# EAGLE schematic midipal-v02 (EAGLE 5.09)
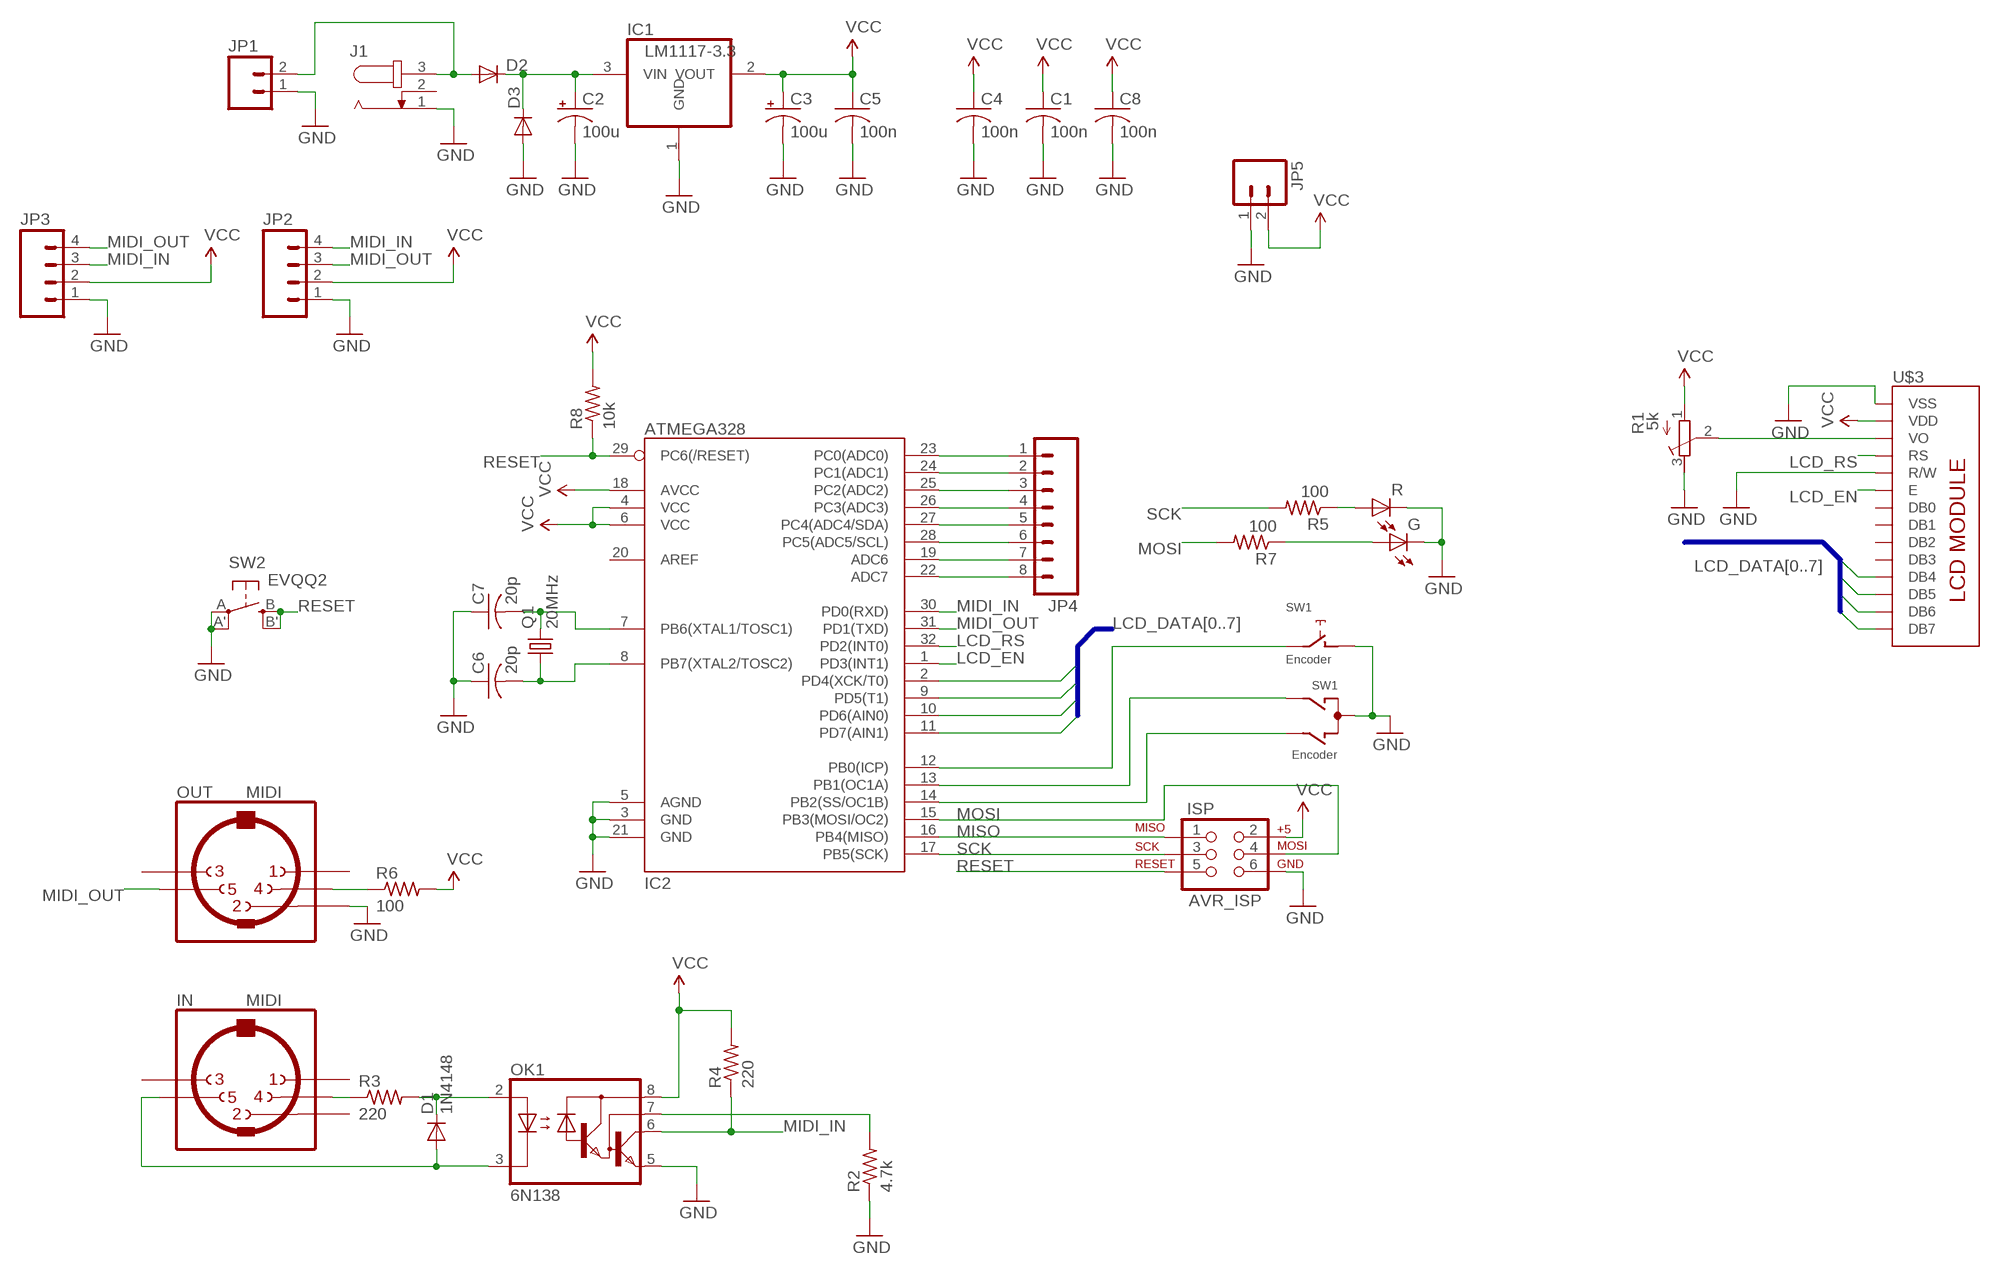
[diagram p0: schematic, sheet 1]

## Parts
C1  100n  C-USC0805  [C0805]
C2  100u  CPOL-USD  [PANASONIC_D]
C3  100u  CPOL-USD  [PANASONIC_D]
C4  100n  C-USC0805  [C0805]
C5  100n  C-USC0805  [C0805]
C6  20p  C-USC0805  [C0805]
C7  20p  C-USC0805  [C0805]
C8  100n  C-USC0805  [C0805]
D1  1N4148  DIODE-SOD323-W  [SOD323-W]
D2  DIODESMB  [SMB-DIODE]
D3  DIODESMB  [SMB-DIODE]
G  LEDCHIPLED_1206  [CHIPLED_1206]
IC1  LM1117-3.3  REG1117  [SOT223]
IC2  ATMEGA328  ATMEGA168  [TQFP32-08]
IN  MIDI  MAB5SH  [MAB5SH]
ISP  AVR_ISP  AVR_SPI_PRG_6PTH  [2X3]
J1  JACK-PLUG2  [SPC4078_BIG_HOLES]
JP1  M02  [1X02_LONGPADS]
JP2  M04PTH  [1X04]
JP3  M04PTH  [1X04]
JP4  M08  [1X08]
JP5  M02PTH  [1X02]
OK1  6N138  6N138SMD8  [DIL8-SMD]
OUT  MIDI  MAB5SH  [MAB5SH]
Q1  20MHz  CRYSTALHC49UP  [HC49UP]
R  LEDCHIPLED_1206  [CHIPLED_1206]
R1  5k  R-TRIMM3296P  [RTRIM3296P]
R2  4.7k  R-US_M0805  [M0805]
R3  220  R-US_M0805  [M0805]
R4  220  R-US_R0805  [R0805]
R5  100  R-US_R0805  [R0805]
R6  100  R-US_R0805  [R0805]
R7  100  R-US_R0805  [R0805]
R8  10k  R-US_R0805  [R0805]
SW1  Encoder  EC12E_SW  [ALPS_EC12E_SW]
SW2  EVQQ2  [EVQ-Q2]
U$3  LCD_MODULE_NO_BKL  [LCD_MODULE_1X8]

## Nets
GND: C1.2 C2.- C3.- C4.2 C5.2 C6.1 C7.1 C8.2 D3.A G.C IC1.1(GND) IC2.3(GND) IC2.5(AGND) IC2.21(GND) ISP.6 J1.1 JP1.1 JP2.1 JP3.1 JP5.1 OK1.5(GND) OUT.2 R1.3(A) R2.1 R.C SW1.C SW1.D SW2.A'(P1) SW2.A(P) U$3.1(VSS) U$3.5(R/W)
LCD_DATA4: IC2.2(PD4(XCK/T0)) U$3.11(DB4)
LCD_DATA5: IC2.9(PD5(T1)) U$3.12(DB5)
LCD_DATA6: IC2.10(PD6(AIN0)) U$3.13(DB6)
LCD_DATA7: IC2.11(PD7(AIN1)) U$3.14(DB7)
LCD_EN: IC2.1(PD3(INT1)) U$3.6(E)
LCD_RS: IC2.32(PD2(INT0)) U$3.4(RS)
MIDI_IN: IC2.30(PD0(RXD)) JP2.4 JP3.3 OK1.6(VO) R4.1
MIDI_OUT: IC2.31(PD1(TXD)) JP2.3 JP3.4 OUT.5
MISO: IC2.16(PB4(MISO)) ISP.1
MOSI: IC2.15(PB3(MOSI/OC2)) ISP.4 R7.2
N$2: C2.+ D2.C D3.C IC1.3(VIN)
N$3: IC2.23(PC0(ADC0)) JP4.1
N$5: IC2.24(PC1(ADC1)) JP4.2
N$6: IC2.25(PC2(ADC2)) JP4.3
N$7: IC2.26(PC3(ADC3)) JP4.4
N$8: IC2.27(PC4(ADC4/SDA)) JP4.5
N$9: IC2.28(PC5(ADC5/SCL)) JP4.6
N$10: IC2.19(ADC6) JP4.7
N$11: IC2.22(ADC7) JP4.8
N$12: G.A R7.1
N$13: OK1.7(VB) R2.2
N$14: R5.1 R.A
N$15: IC2.14(PB2(SS/OC1B)) SW1.B
N$16: IC2.13(PB1(OC1A)) SW1.A
N$17: IC2.12(PB0(ICP)) SW1.E
N$18: R1.2(S) U$3.3(VO)
N$28: D1.C OK1.2(A) R3.2
N$68: OUT.4 R6.1
N$72: IN.4 R3.1
N$73: D1.A IN.5 OK1.3(C)
N$82: C6.2 IC2.8(PB7(XTAL2/TOSC2)) Q1.1
N$83: C7.2 IC2.7(PB6(XTAL1/TOSC1)) Q1.2
RESET: IC2.29(PC6(/RESET)) ISP.5 R8.1 SW2.B'(S1) SW2.B(S)
SCK: IC2.17(PB5(SCK)) ISP.3 R5.2
VCC: C1.1 C3.+ C4.1 C5.1 C8.1 IC1.2(VOUT) IC2.4(VCC) IC2.6(VCC) IC2.18(AVCC) ISP.2 JP2.2 JP3.2 JP5.2 OK1.8(VCC) R1.1(E) R4.2 R6.2 R8.2 U$3.2(VDD)
VIN: D2.A J1.3 JP1.2
Unconnected: IC2.20(AREF) IN.1 IN.2 IN.3 J1.2 OUT.1 OUT.3 SW1.GND1(G) SW1.GND2(G) U$3.7(DB0) U$3.8(DB1) U$3.9(DB2) U$3.10(DB3)

## Buses
LCD_DATA[0..7]

## Library data of the parts
C1 C4-C8 = rcl:C-US: CAPACITOR, American symbol
C2 C3 = rcl:CPOL-US: POLARIZED CAPACITOR, American symbol
D1 = diode:DIODE-: DIODE
D2 D3 = SparkFun:DIODE: Diode These are standard reverse protection diodes and small signal diodes. SMA package can handle up to about 1A. SOD-323 can handle about 200mA. What the SOD-323 package when ordering, there are some mfgs out there that are 5-pin packages.
G R = led:LED: LED OSRAM: - CHIPLED LG R971, LG N971, LY N971, LG Q971, LY Q971, LO R971, LY R971 LH N974, LH R974 LS Q976, LO Q976, LY Q976 LO Q996 - Hyper CHIPLED LW Q18S LB Q993, LB Q99A, LB R99A - SideLED LS A670, LO A670, LY A670, LG A670, LP A670 LB A673, LV A673, LT A673, LW A673 LH A674 LY A675 LS A676, LA A676, LO A676, LY A676, LW A676 LS A679, LY A679, LG A679 - Hyper Micro SIDELED® LS Y876, LA Y876, LO Y876, LY Y876 LT Y87S - SmartLED LW L88C, LW L88S LB L89C, LB L89S, LG L890 LS L89K, LO L89K, LY L89K LS L896, LA L896, LO L896, LY L896 - TOPLED LS T670, LO T670, LY T670, LG T670, LP T670 LSG T670, LSP T670, LSY T670, LOP T670, LYG T670 LG T671, LOG T671, LSG T671 LB T673, LV T673, LT T673, LW T673 LH T674 LS T676, LA T676, LO T676, LY T676, LB T676, LH T676, LSB T676, LW T676 LB T67C, LV T67C, LT T67C, LS T67K, LO T67K, LY T67K, LW E67C LS E67B, LA E67B, LO E67B, LY E67B, LB E67C, LV E67C, LT E67C LW T67C LS T679, LY T679, LG T679 LS T770, LO T770, LY T770, LG T770, LP T770 LB T773, LV T773, LT T773, LW T773 LH T774 LS E675, LA E675, LY E675, LS T675 LS T776, LA T776, LO T776, LY T776, LB T776 LHGB T686 LT T68C, LB T68C - Hyper Mini TOPLED® LB M676 - Mini TOPLED Santana® LG M470 LS M47K, LO M47K, LY M47K Source: http://www.osram.convergy.de LUXEON: - LUMILED® LXK2-PW12-R00, LXK2-PW12-S00, LXK2-PW14-U00, LXK2-PW14-V00 LXK2-PM12-R00, LXK2-PM12-S00, LXK2-PM14-U00 LXK2-PE12-Q00, LXK2-PE12-R00, LXK2-PE12-S00, LXK2-PE14-T00, LXK2-PE14-U00 LXK2-PB12-K00, LXK2-PB12-L00, LXK2-PB12-M00, LXK2-PB14-N00, LXK2-PB14-P00, LXK2-PB14-Q00 LXK2-PR12-L00, LXK2-PR12-M00, LXK2-PR14-Q00, LXK2-PR14-R00 LXK2-PD12-Q00, LXK2-PD12-R00, LXK2-PD12-S00 LXK2-PH12-R00, LXK2-PH12-S00 LXK2-PL12-P00, LXK2-PL12-Q00, LXK2-PL12-R00 Source: www.luxeon.com KINGBRIGHT: KA-3528ASYC Source: www.kingbright.com
IC1 = burr-brown:REG1117: 800mA and 1A Low Dropout (LDO) Positive Regulator 1.8V, 2.5V, 2.85V, 3.3V, 5V, and Adj
IC2 = SparkFun:ATMEGA168
IN OUT = og-midi:MAB5SH: Female CONNECTOR 5 pins 90 deg. with shield, horizontal (DIN 41524)
ISP = SparkFun:AVR_SPI_PRG_6: AVR ISP 6 Pin This is the reduced ISP connector for AVR programming. Common on Arduino. This footprint will take up less PCB space and can be used with a 10-pin to 6-pin adapter such as SKU: BOB-08508
J1 = con-jack2:JACK-PLUG: DC POWER JACK Power Jack, DC, Right Angle, Through Hole, Rated 5A at 16VDC, PC Terminals Distributor: Farnell (www.Farnell.de) Drawing: 84N1161.pdf / 84N1162.pdf Manufacturer: SPC Technology (www.spctechnology.com) Type: SPC4077 / SPC 4078
JP1 JP5 = SparkFun:M02: Header 2 Standard 2-pin 0.1" header. Use with straight break away headers (SKU : PRT-00116), right angle break away headers (PRT-00553), swiss pins (PRT-00743), machine pins (PRT-00117), and female headers (PRT-00115). Molex polarized connector foot print use with SKU : PRT-08233 with associated crimp pins and housings.
JP2 JP3 = SparkFun:M04: Header 4 Standard 4-pin 0.1" header. Use with straight break away headers (SKU : PRT-00116), right angle break away headers (PRT-00553), swiss pins (PRT-00743), machine pins (PRT-00117), and female headers (PRT-00115). Molex polarized connector foot print use with SKU : PRT-08231 with associated crimp pins and housings.
JP4 = SparkFun:M08: Header 8 Standard 8-pin 0.1" header. Use with straight break away headers (SKU : PRT-00116), right angle break away headers (PRT-00553), swiss pins (PRT-00743), machine pins (PRT-00117), and female headers (PRT-00115).
OK1 = og-optocouplers:6N138: MOTOROLA OPTO COUPLER
Q1 = crystal:CRYSTAL: CRYSTAL
R1 = rcl:R-TRIMM: Trimm resistor
R2-R8 = rcl:R-US_: RESISTOR, American symbol
SW1 = switch-alps:EC12E_SW: ALPS rotary Encoder EC12E series with switch
SW2 = adafruit:EVQQ2: SMT 6mm switch, EVQQ2 series http://www.ladyada.net/library/eagle
U$3 = og-lcd:LCD_MODULE_NO_BKL